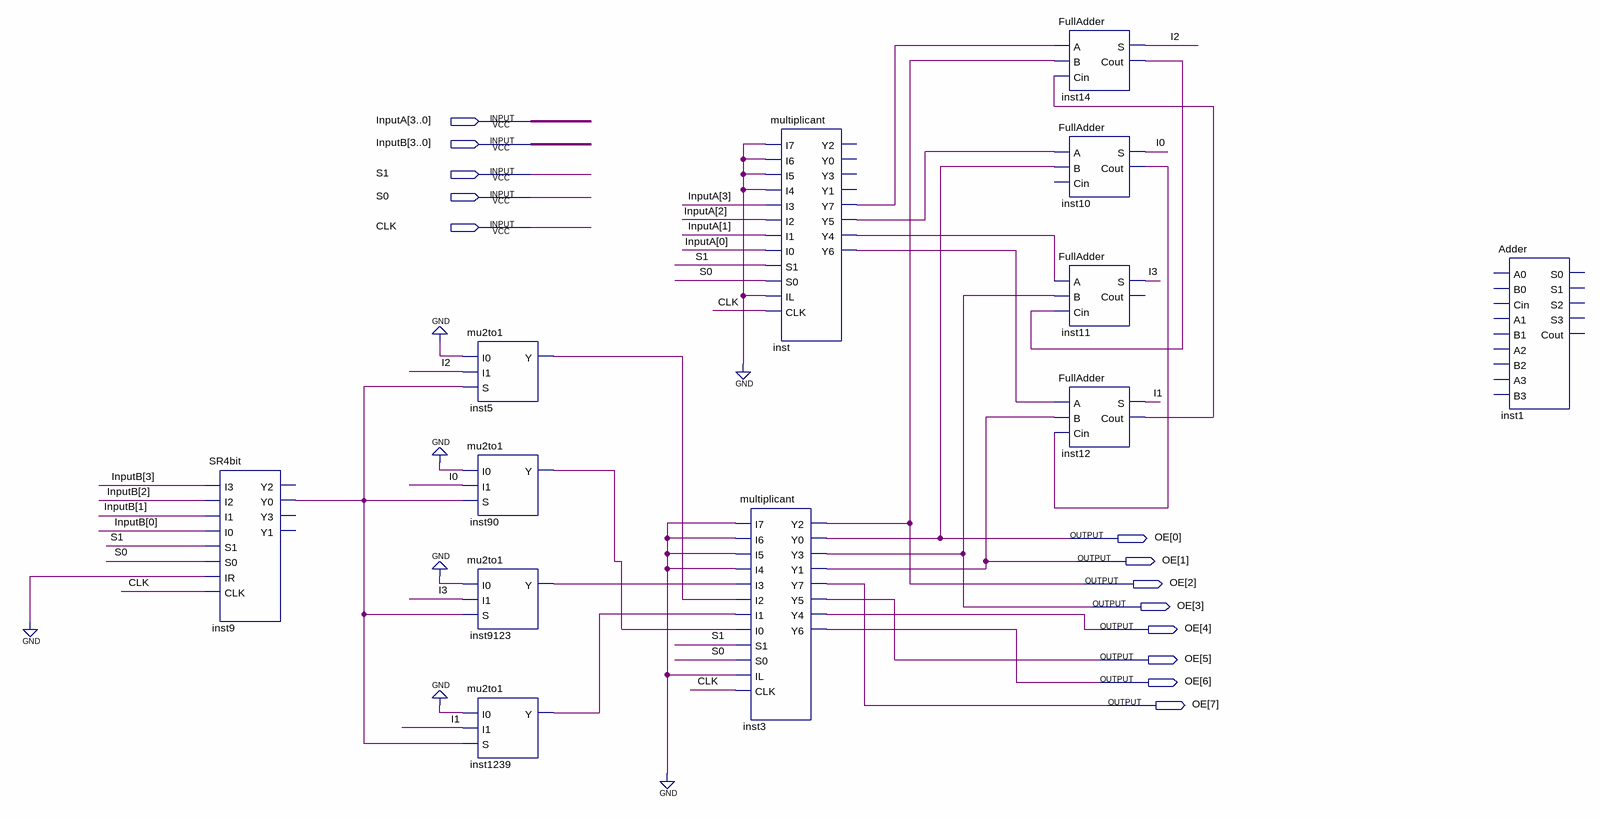
[diagram p0: schematic sheet]
// Quartus schematic Lab3.bdf as structural Verilog: 12 symbols, 13 pins
module Lab3 (
  input  [3:0] InputA,
  input  [3:0] InputB,
  input  S1,
  input  S0,
  input  CLK,
  output [7:0] OE
);

  wire I0, I1, I2, I3, inst5_y, inst9_y0, inst10_cout, inst12_cout, inst14_cout, inst90_y, inst1239_y,
       inst9123_y, inst_y4, inst_y5, inst_y6, inst_y7;

  SR4bit inst9 (
    .I3(InputB[3]), .I2(InputB[2]), .I1(InputB[1]), .I0(InputB[0]), .S1(S1), .S0(S0), .IR(1'b0), .CLK(CLK),
    .Y0(inst9_y0));  // open: Y2, Y3, Y1
  mu2to1 inst5 (.I0(1'b0), .I1(I2), .S(inst9_y0), .Y(inst5_y));
  mu2to1 inst90 (.I0(1'b0), .I1(I0), .S(inst9_y0), .Y(inst90_y));
  mu2to1 inst9123 (.I0(1'b0), .I1(I3), .S(inst9_y0), .Y(inst9123_y));
  mu2to1 inst1239 (.I0(1'b0), .I1(I1), .S(inst9_y0), .Y(inst1239_y));
  multiplicant inst3 (
    .I7(1'b0), .I6(1'b0), .I5(1'b0), .I4(1'b0), .I3(inst9123_y), .I2(inst5_y), .I1(inst1239_y),
    .I0(inst90_y), .S1(S1), .S0(S0), .IL(1'b0), .CLK(CLK), .Y2(OE[2]), .Y0(OE[0]), .Y3(OE[3]), .Y1(OE[1]),
    .Y7(OE[7]), .Y5(OE[5]), .Y4(OE[4]), .Y6(OE[6]));
  multiplicant inst (
    .I7(1'b0), .I6(1'b0), .I5(1'b0), .I4(1'b0), .I3(InputA[3]), .I2(InputA[2]), .I1(InputA[1]),
    .I0(InputA[0]), .S1(S1), .S0(S0), .IL(1'b0), .CLK(CLK), .Y7(inst_y7), .Y5(inst_y5), .Y4(inst_y4),
    .Y6(inst_y6));  // open: Y2, Y0, Y3, Y1
  FullAdder inst14 (.A(inst_y7), .B(OE[2]), .Cin(inst12_cout), .S(I2), .Cout(inst14_cout));
  FullAdder inst10 (.A(inst_y5), .B(OE[0]), .S(I0), .Cout(inst10_cout));  // open: Cin
  FullAdder inst11 (.A(inst_y4), .B(OE[3]), .Cin(inst14_cout), .S(I3));  // open: Cout
  FullAdder inst12 (.A(inst_y6), .B(OE[1]), .Cin(inst10_cout), .S(I1), .Cout(inst12_cout));
  Adder inst1 ();  // open: A0, B0, Cin, A1, B1, A2, B2, A3, B3, S0, S1, S2, S3, Cout
endmodule
